# Altium schematic sheet dcdc5v.SchDoc
size 420 x 297 mm; Organization: Yandex; Address2: 11 Timura Frunze st., building 2; SheetNumber: 4; SheetTotal: 8; Release_Date: yyyy-mm-dd; Language: en; Organization2: Self Driving Group LLC
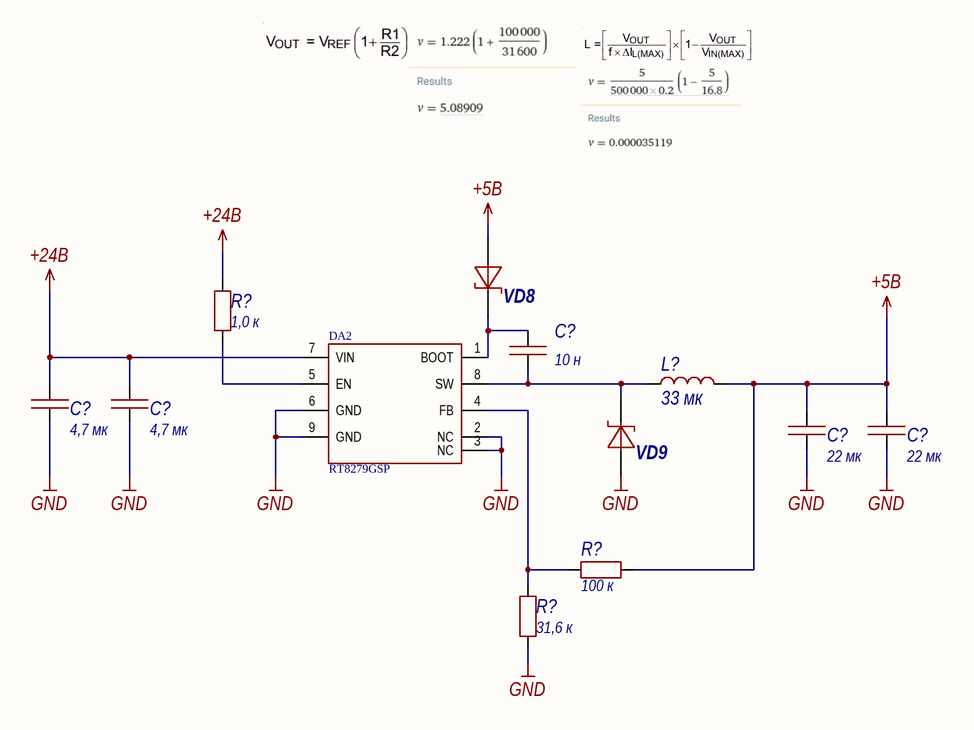
[diagram p0: dcdc5v.SchDoc]

## Parts
(Parts that share a designator on the sheet are numbered #1, #2 ... from top to bottom, then left to right.)
C?#1  value 10 н  [0603C]  (hidden comment: Capacitor)
C?#2  value 4,7 мк  [1206C]  (hidden comment: Capacitor)
C?#3  value 4,7 мк  [1206C]  (hidden comment: Capacitor)
C?#4  value 22 мк  [1210C]  (hidden comment: Capacitor)
C?#5  value 22 мк  [1210C]  (hidden comment: Capacitor)
DA2  RT8279GSP  [8SOP(Exposed_Pad)]
L?  value 33 мк  [IHLP-4040]  (hidden comment: IHLP4040DZER330M11)
R?#1  value 1,0 к  [0603R]  (hidden comment: Resistor)
R?#2  value 100 к  [0603R]  (hidden comment: Resistor)
R?#3  value 31,6 к  [0603R]  (hidden comment: Resistor)
VD8  BAT54WS  [SOD-323]  (value not drawn)
VD9  10S45SP  [TO-277]  (value not drawn)

## Nets
+5В: C?#4.2 C?#5.2 L?.2 R?#2.2 VD8.1
+24В: C?#2.2 C?#3.2 DA2.7(VIN) R?#1.2
GND: C?#2.1 C?#3.1 C?#4.1 C?#5.1 DA2.2(NC) DA2.3(NC) DA2.6(GND) DA2.9(GND) R?#3.1 VD9.1
NetC?#1_1: C?#1.1 DA2.8(SW) L?.1 VD9.2
NetC?#1_2: C?#1.2 DA2.1(BOOT) VD8.2
NetDA2_4: DA2.4(FB) R?#2.1 R?#3.2
NetDA2_5: DA2.5(EN) R?#1.1

## Notes on the sheet
- Перв. примен.
- Справ. №
- Подп. и дата
- Инв. № дубл.
- Взам. инв. №
- Инв. № подл.
- Изм.
- Лист
- № докум.
- Подп.
- Дата
- Копировал
- Формат А3

## Library data of the parts
C?#1 = Capacitor_10n_10_50V_X7R_0603C: Конденсатор; Library Path2: Schematic\Capacitor.SchLib; Tolerance: 0,1; Voltage (V): 50; Dielectric: X7R; Capacity (nF): 10; Part Number: Capacitor_10n_10_50V_X7R_0603C
C?#2 C?#3 = Capacitor_4,7u_10_50V_X7R_1206C: Конденсатор; Library Path2: Schematic\Capacitor.SchLib; Tolerance: 0,1; Voltage (V): 50; Dielectric: X7R; Capacity (nF): 4700; Part Number: Capacitor_4,7u_10_50V_X7R_1206C
C?#4 C?#5 = Capacitor_22u_10_25V_X7R_1210C: Конденсатор; Library Path2: Schematic\Capacitor.SchLib; Tolerance: 0,1; Voltage (V): 25; Dielectric: X7R; Capacity (nF): 22000; Part Number: Capacitor_22u_10_25V_X7R_1210C
DA2 = RT8279GSP: Преобразователь постоянного тока понижающий подстраиваемый выход 5А; Part Number: RT8279GSP
L? = IHLP4040DZER330M11: ЧИП-индуктивность экранированная 33мкГн ±20% 4,4A 94,5мОм 4040; Inductance (μH): 33; Current (A): 4,4; Part Number: IHLP4040DZER330M11
R?#1 = Resistor_1.0k_1_0603: Резистор номиналом 1,0 кОм и точностью 1%; Power: *; Part Number: Resistor_1.0k_1_0603; Tolerance: 1%
R?#2 = Resistor_100k_1_0603: Резистор номиналом 100 кОм и точностью 1%; Power: *; Part Number: Resistor_100k_1_0603; Tolerance: 1%
R?#3 = Resistor_31.6k_1_0603: Резистор номиналом 31,6 кОм и точностью 1%; Power: *; Part Number: Resistor_31.6k_1_0603; Tolerance: 1%
VD8 = BAT54WS: Диод шоттки на 30 В, ном. ток 0.2 А; Voltage nominal (V): 30; Current (A): 0.2; Part Number: BAT54WS
VD9 = 10S45SP: Диод шоттки на 45 В, ном. ток 10 А; Voltage nominal (V): 45; Current (A): 10; Part Number: 10S45SP